# Altium project SDR2.PrjPcb (part 2 of 2)

## Sheet Ethernet.SchDoc: uSDR schematic
size Letter; Author: Ye-sheng Kuo; CompanyName: Univ. of Michigan; Revision: 2.0; SheetNumber: 7; SheetTotal: 16
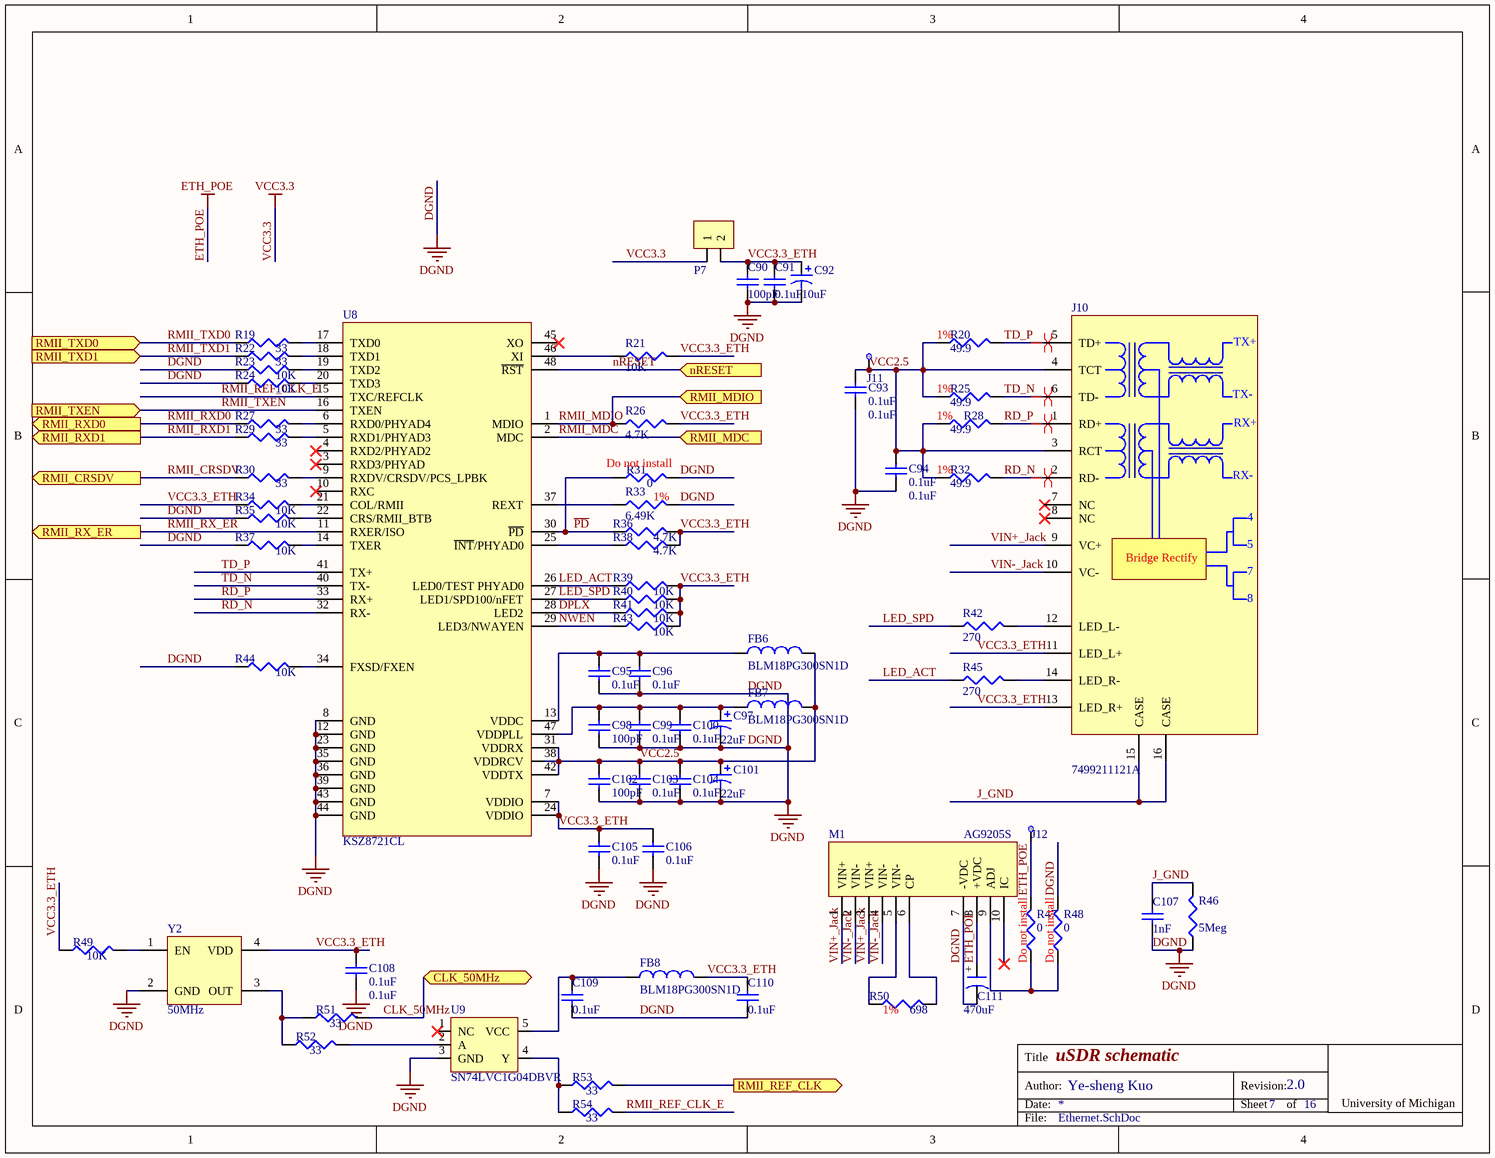
[diagram p10: Ethernet.SchDoc]

### Parts
C90  100pF  [0402]
C91  0.1uF  [0402]
C92  10uF  [C0805]
C93  0.1uF  [0402]
C94  0.1uF  [0402]
C95  0.1uF  [0402]
C96  0.1uF  [0402]
C97  22uF  [C0805]
C98  100pF  [0402]
C99  0.1uF  [0402]
C100  0.1uF  [0402]
C101  22uF  [C0805]
C102  100pF  [0402]
C103  0.1uF  [0402]
C104  0.1uF  [0402]
C105  0.1uF  [0402]
C106  0.1uF  [0402]
C107  1nF  [0402]
C108  0.1uF  [0402]
C109  0.1uF  [0402]
C110  0.1uF  [0402]
C111  470uF  [SMT Al Cap.]
FB6  BLM18PG300SN1D  [1608[0603]]
FB7  BLM18PG300SN1D  [1608[0603]]
FB8  BLM18PG300SN1D  [1608[0603]]
J10  7499211121A  [7499211121A]
J11  5004  [TestPoint]  (value not drawn)
J12  5004  [TestPoint]  (value not drawn)
M1  AG9205S  [AG9205S]
P7  1 x 2 header  [1x2 header]  (value not drawn)
R19  33  [0402]
R20  49.9  [0402]
R21  10K  [0402]
R22  33  [0402]
R23  10K  [0402]
R24  10K  [0402]
R25  49.9  [0402]
R26  4.7K  [0402]
R27  33  [0402]
R28  49.9  [0402]
R29  33  [0402]
R30  33  [0402]
R31  0  [0402]
R32  49.9  [0402]
R33  6.49K  [0402]
R34  10K  [0402]
R35  10K  [0402]
R36  4.7K  [0402]
R37  10K  [0402]
R38  4.7K  [0402]
R39  10K  [0402]
R40  10K  [0402]
R41  10K  [0402]
R42  270  [0402]
R43  10K  [0402]
R44  10K  [0402]
R45  270  [0402]
R46  value 5Meg  [J1-0603]  (hidden comment: 5M)
R47  0  [0402]
R48  0  [0402]
R49  10K  [0402]
R50  698  [0402]
R51  33  [0402]
R52  33  [0402]
R53  33  [0402]
R54  33  [0402]
U8  KSZ8721CL  [TSQFP50P900X900X160-48N]
U9  SN74LVC1G04DBVR  [SOT23-5]
Y2  value 50MHz  [CB3_CB3LV]  (hidden comment: CB3LV-3C-50M0000)

### Ports
CLK_50MHz (bidir), nRESET (in), RMII_CRSDV (out), RMII_MDC (in), RMII_MDIO (in), RMII_REF_CLK (out), RMII_RX_ER (out), RMII_RXD0 (out), RMII_RXD1 (out), RMII_TXD0 (in), RMII_TXD1 (in), RMII_TXEN (in)

### Nets
DGND: C90.1 C91.1 C92.2 C93.1 C94.1 C95.1 C96.1 C97.2 C98.1 C99.1 C100.1 C101.2 C102.1 C103.1 C104.1 C105.1 C106.1 C107.1 C108.1 C109.1 C110.1 C111.- M1.7(-VDC) R23.1 R24.1 R31.2 R33.2 R35.1 R37.1 R44.1 R46.1 R48.2 U8.8(GND) U8.12(GND) U8.23(GND) U8.35(GND) U8.36(GND) U8.39(GND) U8.43(GND) U8.44(GND) U9.3(GND) Y2.2(GND)
ETH_POE: C111.+ J12.1(TB) M1.8(+VDC) R47.2
VCC3.3: P7.1
CLK_50MHz: R51.2 ; port CLK_50MHz
DPLX: R41.1 U8.28(LED2)
J_GND: C107.2 J10.15(CASE) J10.16(CASE) R46.2
LED_ACT: R39.1 R45.1 U8.26(LED0/TEST_PHYAD0)
LED_SPD: R40.1 R42.1 U8.27(LED1/SPD100/nFET)
nRESET: U8.48(~{RST}) ; port nRESET
NWEN: R43.1 U8.29(LED3/NWAYEN)
~{PD}: R31.1 R36.1 U8.30(~{PD})
RD_N: J10.2(RD-) R32.2 U8.32(RX-)
RD_P: J10.1(RD+) R28.2 U8.33(RX+)
RMII_CRSDV: R30.1 ; port RMII_CRSDV
RMII_MDC: U8.2(MDC) ; port RMII_MDC
RMII_MDIO: R26.1 U8.1(MDIO) ; port RMII_MDIO
RMII_REF_CLK: R53.2 ; port RMII_REF_CLK
RMII_REF_CLK_E: R54.2 U8.15(TXC/REFCLK)
RMII_RX_ER: U8.11(RXER/ISO) ; port RMII_RX_ER
RMII_RXD0: R27.1 ; port RMII_RXD0
RMII_RXD1: R29.1 ; port RMII_RXD1
RMII_TXD0: R19.1 ; port RMII_TXD0
RMII_TXD1: R22.1 ; port RMII_TXD1
RMII_TXEN: U8.16(TXEN) ; port RMII_TXEN
TD_N: J10.6(TD-) R25.2 U8.40(TX-)
TD_P: J10.5(TD+) R20.2 U8.41(TX+)
VCC2.5: C93.2 C94.2 C101.1 C102.2 C103.2 C104.2 FB6.2 FB7.2 J10.3(RCT) J10.4(TCT) J11.1(TB) R20.1 R25.1 R28.1 R32.1 U8.31(VDDRX) U8.38(VDDRCV) U8.42(VDDTX)
VCC3.3_ETH: C90.2 C91.2 C92.1 C105.2 C106.2 C108.2 C110.2 FB8.2 J10.11(LED_L+) J10.13(LED_R+) P7.2 R21.2 R26.2 R34.1 R36.2 R38.2 R39.2 R40.2 R41.2 R43.2 R49.1 U8.7(VDDIO) U8.24(VDDIO) Y2.4(VDD)
VIN+_Jack: J10.9(VC+) M1.1(VIN+) M1.3(VIN+)
VIN-_Jack: J10.10(VC-) M1.2(VIN-) M1.4(VIN-)
NetC95_2: C95.2 C96.2 FB6.1 U8.13(VDDC)
NetC97_1: C97.1 C98.2 C99.2 C100.2 FB7.1 U8.47(VDDPLL)
NetC109_2: C109.2 FB8.1 U9.5(VCC)
NetJ10_12: J10.12(LED_L-) R42.2
NetJ10_14: J10.14(LED_R-) R45.2
NetM1_5: M1.5(VIN-) R50.1
NetM1_6: M1.6(CP) R50.2
NetM1_9: M1.9(ADJ) R47.1 R48.1
NetR19_2: R19.2 U8.17(TXD0)
NetR21_1: R21.1 U8.46(XI)
NetR22_2: R22.2 U8.18(TXD1)
NetR23_2: R23.2 U8.19(TXD2)
NetR24_2: R24.2 U8.20(TXD3)
NetR27_2: R27.2 U8.6(RXD0/PHYAD4)
NetR29_2: R29.2 U8.5(RXD1/PHYAD3)
NetR30_2: R30.2 U8.9(RXDV/CRSDV/PCS_LPBK)
NetR33_1: R33.1 U8.37(REXT)
NetR34_2: R34.2 U8.21(COL/RMII)
NetR35_2: R35.2 U8.22(CRS/RMII_BTB)
NetR37_2: R37.2 U8.14(TXER)
NetR38_1: R38.1 U8.25(~{INT}/PHYAD0)
NetR44_2: R44.2 U8.34(FXSD/FXEN)
NetR49_2: R49.2 Y2.1(EN)
NetR51_1: R51.1 R52.1 Y2.3(OUT)
NetR52_2: R52.2 U9.2(A)
NetR53_1: R53.1 R54.1 U9.4(Y)

Not connected (* = marked no-connect by the designer): J10 7(NC)* 8(NC)*; M1 10(IC)*; U8 3(RXD3/PHYAD)* 4(RXD2/PHYAD2)* 10(RXC)* 45(XO)*; U9 1(NC)*

### Layout directives
differential pair: RD_N, RD_P, TD_N, TD_P

### Notes on the sheet
- (near R20) 1%
- (near R25) 1%
- (near R28) 1%
- (near R31) Do not install
- (near R33) 1%
- (near R32) 1%
- (near R47) Do not install
- (near R48) Do not install
- (near R50) 1%
- Title
- Date:
- Author:
- Revision:
- Sheet
- of
- University of Michigan
- File:
- (in symbol Ethernet Jack PoE) TX+; TX-; RX+; RX-; Bridge Rectify

### Library data of the parts
C90 C91 C93-C96 C98-C100 C102-C110 = Cap Semi: Capacitor (Semiconductor SIM Model); Published: 8-Jun-2000; LatestRevisionDate: 29-May-2009; LatestRevisionNote: IPC-7351 Footprint Added.; PackageReference: C1206; Publisher: Altium Limited; PackageDescription: Chip Capacitor
  C90 C98 C102: Value: 100pF
  C91 C93-C96 C99 C100 C103-C106 C108-C110: Value: 0.1uF
  C107: Value: 1nF
C92 C97 C101 = Cap Pol3: Polarized Capacitor (Surface Mount); Published: 8-Jun-2000; LatestRevisionDate: 29-May-2009; LatestRevisionNote: IPC-7351 Footprint Added.; PackageReference: C0805; Publisher: Altium Limited; PackageDescription: Chip Capacitor
  C92: Value: 10uF
  C97 C101: Value: 22uF
C111 = Cap: Value: 470uF; Supplier 1: Digi-Key; Supplier Part Number 1: PCE3184CT-ND
FB6-FB8 = Ferrite Bead: FERRITE CHIP 30 OHM 1000MA 0603; Supplier 1: Digi-Key; Supplier Part Number 1: 490-1035-2-ND
J10 = Ethernet Jack PoE: CONN RJ45 8-8 W/TRANSFORMER; Supplier 1: Digi-Key; Supplier Part Number 1: 732-1654-ND
J11 J12 = TestPoint: TEST POINT PC MINI .040"D YELLOW; Supplier 1: Digi-Key; Supplier Part Number 1: 5004K-ND; datasheet: http://mail.keyelco.com/ENG._DEPT/PDF%20CAT%20NO%20Drawings/5004.pdf
M1 = AG9205S: Silver Telecom AG9205S POE; Value: 5V; datasheet: http://www.silvertel.com/DataSheets/Ag9200v1-7.pdf
P7 = 1 x 2 header: 100 mils standard header
R19-R54 = Res3: Resistor; Published: 8-Jun-2000; LatestRevisionDate: 29-May-2009; LatestRevisionNote: IPC-7351 Footprint Added.; PackageReference: J1-0603; Publisher: Altium Limited; PackageDescription: Chip Resistor
  R19 R22 R27 R29 R30 R51-R54: Value: 33
  R20 R25 R28 R32: Value: 49.9
  R21 R23 R24 R34 R35 R37 R39-R41 R43 R44 R49: Value: 10K
  R26 R36 R38: Value: 4.7K
  R31 R47 R48: Value: 0
  R33: Value: 6.49K
  R42 R45: Value: 270
  R50: Value: 698
U8 = KSZ8721CL: IC TXRX PHY 10/100 3.3V 48-LQFP; Supplier 1: Digi-Key; Supplier Part Number 1: 576-1673-ND
U9 = SN74LVC1G04DBV: IC SINGLE INVERTER-GATE SOT-23-5; Supplier 1: Digi-Key; Supplier Part Number 1: 296-11599-1-ND
Y2 = CB3_CB3LV: OSC 50.000 MHZ 3.3V SMD; Supplier 1: Digi-Key; Supplier Part Number 1: CTX283LVCT-ND

## Sheet DAC.SchDoc: uSDR schematic
size Letter; Author: Ye-sheng Kuo; CompanyName: Univ. of Michigan; Revision: 2.0; SheetNumber: 4; SheetTotal: 16
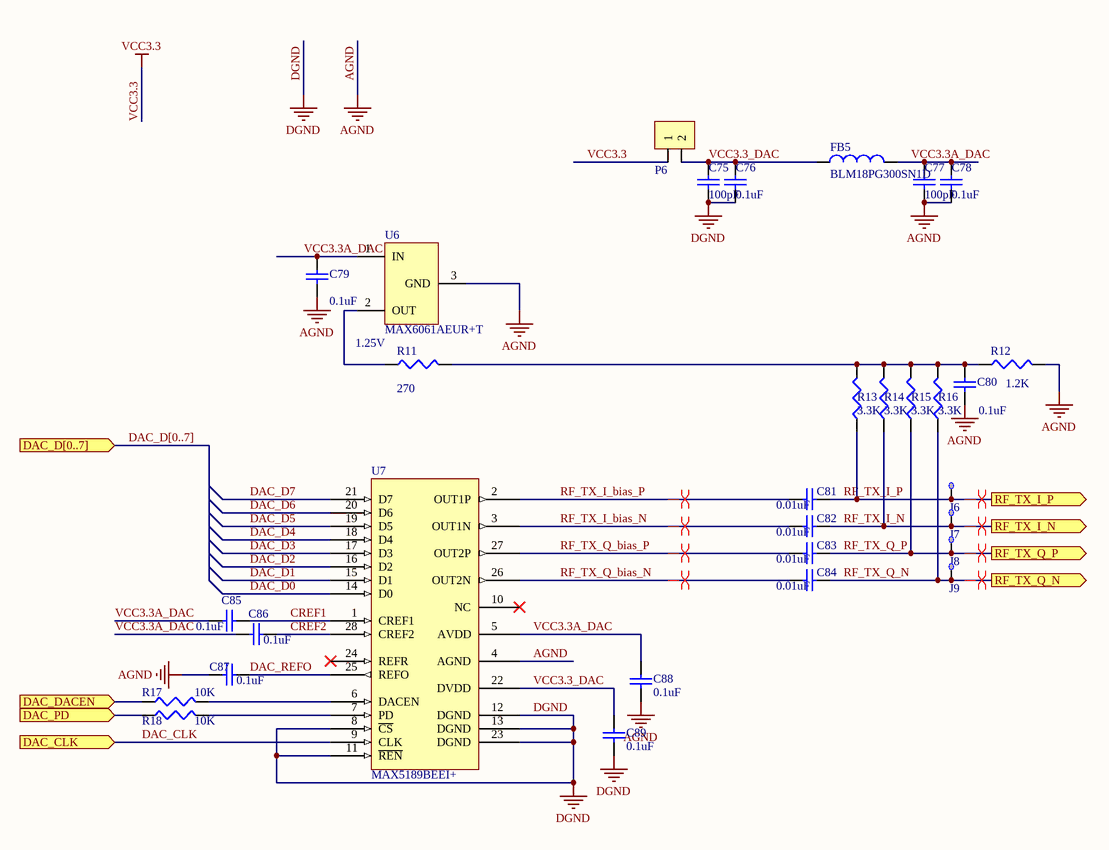
[diagram p11: DAC.SchDoc]

### Parts
C75  100pF  [0402]
C76  0.1uF  [0402]
C77  100pF  [0402]
C78  0.1uF  [0402]
C79  0.1uF  [0402]
C80  0.1uF  [0402]
C81  0.01uF  [0402]
C82  0.01uF  [0402]
C83  0.01uF  [0402]
C84  0.01uF  [0402]
C85  0.1uF  [0402]
C86  0.1uF  [0402]
C87  0.1uF  [0402]
C88  0.1uF  [0402]
C89  0.1uF  [0402]
FB5  BLM18PG300SN1D  [1608[0603]]
J6  5004  [TestPoint]  (value not drawn)
J7  5004  [TestPoint]  (value not drawn)
J8  5004  [TestPoint]  (value not drawn)
J9  5004  [TestPoint]  (value not drawn)
P6  1 x 2 header  [1x2 header]  (value not drawn)
R11  270  [0402]
R12  1.2K  [0402]
R13  3.3K  [0402]
R14  3.3K  [0402]
R15  3.3K  [0402]
R16  3.3K  [0402]
R17  10K  [0402]
R18  10K  [0402]
U6  MAX6061AEUR+T  value 1.25V  [SOT23-3N]
U7  MAX5189BEEI+  [SOP63P600X173-28N]

### Ports
DAC_CLK (in), DAC_D[0..7] (in), DAC_DACEN (in), DAC_PD (in), RF_TX_I_N (out), RF_TX_I_P (out), RF_TX_Q_N (out), RF_TX_Q_P (out)

### Nets
AGND: C77.1 C78.1 C79.1 C80.1 C87.1 C88.2 R12.2 U6.3(GND) U7.4(AGND)
DGND: C75.1 C76.1 C89.2 U7.8(~{CS}) U7.11(~{REN}) U7.12(DGND) U7.13(DGND) U7.23(DGND)
VCC3.3: P6.1
CREF1: C85.2 U7.1(CREF1)
CREF2: C86.2 U7.28(CREF2)
DAC_CLK: U7.9(CLK) ; port DAC_CLK
DAC_D0: U7.14(D0)
DAC_D1: U7.15(D1)
DAC_D2: U7.16(D2)
DAC_D3: U7.17(D3)
DAC_D4: U7.18(D4)
DAC_D5: U7.19(D5)
DAC_D6: U7.20(D6)
DAC_D7: U7.21(D7)
DAC_DACEN: R17.1 ; port DAC_DACEN
DAC_PD: R18.1 ; port DAC_PD
DAC_REFO: C87.2 U7.25(REFO)
RF_TX_I_bias_N: C82.1 U7.3(OUT1N)
RF_TX_I_bias_P: C81.1 U7.2(OUT1P)
RF_TX_I_N: C82.2 J7.1(TB) R14.1 ; port RF_TX_I_N
RF_TX_I_P: C81.2 J6.1(TB) R13.1 ; port RF_TX_I_P
RF_TX_Q_bias_N: C84.1 U7.26(OUT2N)
RF_TX_Q_bias_P: C83.1 U7.27(OUT2P)
RF_TX_Q_N: C84.2 J9.1(TB) R16.1 ; port RF_TX_Q_N
RF_TX_Q_P: C83.2 J8.1(TB) R15.1 ; port RF_TX_Q_P
VCC3.3_DAC: C75.2 C76.2 C89.1 FB5.1 P6.2 U7.22(DVDD)
VCC3.3A_DAC: C77.2 C78.2 C79.2 C85.1 C86.1 C88.1 FB5.2 U6.1(IN) U7.5(AVDD)
NetC80_2: C80.2 R11.2 R12.1 R13.2 R14.2 R15.2 R16.2
NetR11_1: R11.1 U6.2(OUT)
NetR17_2: R17.2 U7.6(DACEN)
NetR18_2: R18.2 U7.7(PD)

Not connected (* = marked no-connect by the designer): U7 10(NC)* 24(REFR)*

### Buses and harness runs
bus DAC_D[0..7] = port DAC_D[0..7]

### Layout directives
differential pair: RF_TX_I_bias_N, RF_TX_I_bias_P, RF_TX_I_N, RF_TX_I_P, RF_TX_Q_bias_N, RF_TX_Q_bias_P, RF_TX_Q_N, RF_TX_Q_P

### Notes on the sheet
- Title
- Date:
- Author:
- Revision:
- Sheet
- of
- University of Michigan
- File:

### Library data of the parts
C75-C89 = Cap Semi: Capacitor (Semiconductor SIM Model); Published: 8-Jun-2000; LatestRevisionDate: 29-May-2009; LatestRevisionNote: IPC-7351 Footprint Added.; PackageReference: C1206; Publisher: Altium Limited; PackageDescription: Chip Capacitor
  C75 C77: Value: 100pF
  C76 C78-C80 C85-C89: Value: 0.1uF
  C81-C84: Value: 0.01uF
FB5 = Ferrite Bead: FERRITE CHIP 30 OHM 1000MA 0603; Supplier 1: Digi-Key; Supplier Part Number 1: 490-1035-2-ND
J6-J9 = TestPoint: TEST POINT PC MINI .040"D YELLOW; Supplier 1: Digi-Key; Supplier Part Number 1: 5004K-ND; datasheet: http://mail.keyelco.com/ENG._DEPT/PDF%20CAT%20NO%20Drawings/5004.pdf
P6 = 1 x 2 header: 100 mils standard header
R11-R18 = Res3: Resistor; Published: 8-Jun-2000; LatestRevisionDate: 29-May-2009; LatestRevisionNote: IPC-7351 Footprint Added.; PackageReference: J1-0603; Publisher: Altium Limited; PackageDescription: Chip Resistor
  R11: Value: 270
  R12: Value: 1.2K
  R13-R16: Value: 3.3K
  R17 R18: Value: 10K
U6 = MAX6061: IC REF VOLT LDO SOT23-3; Supplier 1: Digi-Key; Supplier Part Number 1: MAX6061AEUR+TCT-ND
U7 = MAX5189: IC DAC 8BIT DUAL 40MHZ 28-QSOP; Supplier 1: Digi-Key; Supplier Part Number 1: MAX5189BEEI+-ND

## Sheet RF.SchDoc: uSDR schematic
size Letter; Author: Ye-sheng Kuo; CompanyName: Univ. of Michigan; Revision: 2.0; SheetNumber: 5; SheetTotal: 16
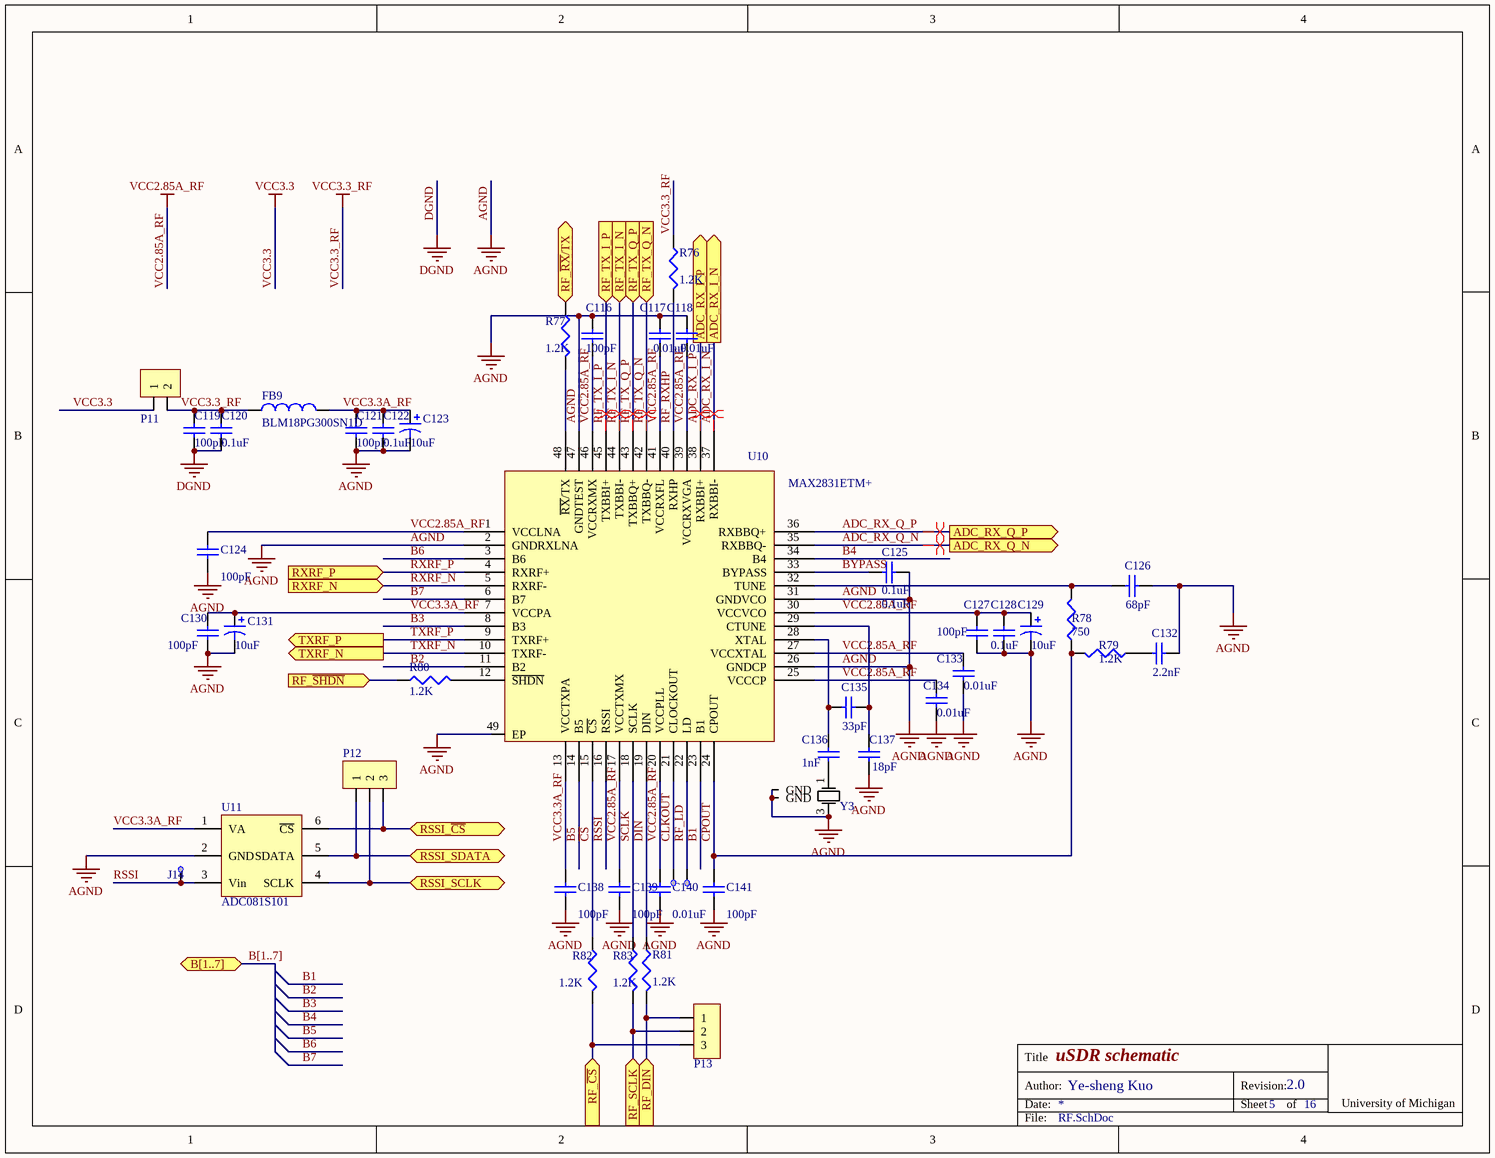
[diagram p12: RF.SchDoc]

### Parts
C116  100pF  [0402]
C117  0.01uF  [0402]
C118  0.01uF  [0402]
C119  100pF  [0402]
C120  0.1uF  [0402]
C121  100pF  [0402]
C122  0.1uF  [0402]
C123  10uF  [C0805]
C124  100pF  [0402]
C125  0.1uF  [0402]
C126  68pF  [0402]
C127  100pF  [0402]
C128  0.1uF  [0402]
C129  10uF  [C0805]
C130  100pF  [0402]
C131  10uF  [C0805]
C132  2.2nF  [0402]
C133  0.01uF  [0402]
C134  0.01uF  [0402]
C135  33pF  [0402]
C136  1nF  [0402]
C137  18pF  [0402]
C138  100pF  [0402]
C139  100pF  [0402]
C140  0.01uF  [0402]
C141  100pF  [0402]
FB9  BLM18PG300SN1D  [1608[0603]]
J14  5004  [TestPoint]  (value not drawn)
J15  5004  [TestPoint]  (value not drawn)
J16  5004  [TestPoint]  (value not drawn)
P11  1 x 2 header  [1x2 header]  (value not drawn)
P12  1 x 3 header  [1x3 header]  (value not drawn)
P13  1 x 3 header  [1x3 header]  (value not drawn)
R76  1.2K  [0402]
R77  1.2K  [0402]
R78  750  [0402]
R79  1.2K  [0402]
R80  1.2K  [0402]
R81  1.2K  [0402]
R82  1.2K  [0402]
R83  1.2K  [0402]
U10  MAX2831ETM+  [TQFN-48]
U11  ADC081S101  [SOT23-6]
Y3  CX2520SB40000H0DZF08  [CX-2520SB]  (value not drawn)

### Ports
ADC_RX_I_N (out), ADC_RX_I_P (out), ADC_RX_Q_N (out), ADC_RX_Q_P (out), B[1..7] (bidir), RF_DIN (in), RF_SCLK (in), RF_TX_I_N (in), RF_TX_I_P (in), RF_TX_Q_N (in), RF_TX_Q_P (in), RF_~{CS} (in), RF_~{RX}/TX (in), RF_~{SHDN} (in), RSSI_SCLK (bidir), RSSI_SDATA (bidir), RSSI_~{CS} (bidir), RXRF_N (in), RXRF_P (in), TXRF_N (out), TXRF_P (out)

### Nets
AGND: C116.2 C117.2 C118.2 C121.1 C122.1 C123.2 C124.1 C125.2 C126.2 C127.1 C128.1 C129.2 C130.1 C131.2 C132.2 C133.1 C134.1 C137.1 C138.1 C139.1 C140.1 C141.1 U10.2(GNDRXLNA) U10.26(GNDCP) U10.31(GNDVCO) U10.47(GNDTEST) U10.49(EP) U11.2(GND) Y3.2(GND) Y3.3(HOT) Y3.4(GND)
DGND: C119.1 C120.1
VCC2.85A_RF: C116.1 C117.1 C118.1 C124.2 C127.2 C128.2 C129.1 C133.2 C134.2 C139.2 C140.2 U10.1(VCCLNA) U10.17(VCCTXMX) U10.20(VCCPLL) U10.25(VCCCP) U10.27(VCCXTAL) U10.30(VCCVCO) U10.39(VCCRXVGA) U10.41(VCCRXFL) U10.46(VCCRXMX)
VCC3.3: P11.1
VCC3.3_RF: C119.2 C120.2 FB9.1 P11.2 R76.1
ADC_RX_I_N: U10.37(RXBBI-) ; port ADC_RX_I_N
ADC_RX_I_P: U10.38(RXBBI+) ; port ADC_RX_I_P
ADC_RX_Q_N: U10.35(RXBBQ-) ; port ADC_RX_Q_N
ADC_RX_Q_P: U10.36(RXBBQ+) ; port ADC_RX_Q_P
B1: U10.23(B1)
B2: U10.11(B2)
B3: U10.8(B3)
B4: U10.34(B4)
B5: U10.14(B5)
B6: U10.3(B6)
B7: U10.6(B7)
BYPASS: C125.1 U10.33(BYPASS)
~{CS}: R82.1 U10.15(~{CS})
CLKOUT: J15.1(TB) U10.21(CLOCKOUT)
CPOUT: C141.2 R78.1 R79.2 U10.24(CPOUT)
DIN: R81.1 U10.19(DIN)
RF_~{CS}: P13.3 R82.2 ; port RF_~{CS}
RF_DIN: P13.1 R81.2 ; port RF_DIN
RF_LD: J16.1(TB) U10.22(LD)
RF_~{RX}/TX: R77.1 ; port RF_~{RX}/TX
RF_RXHP: R76.2 U10.40(RXHP)
RF_~{SHDN}: R80.1 ; port RF_~{SHDN}
RF_SCLK: P13.2 R83.2 ; port RF_SCLK
RF_TX_I_N: U10.44(TXBBI-) ; port RF_TX_I_N
RF_TX_I_P: U10.45(TXBBI+) ; port RF_TX_I_P
RF_TX_Q_N: U10.42(TXBBQ-) ; port RF_TX_Q_N
RF_TX_Q_P: U10.43(TXBBQ+) ; port RF_TX_Q_P
RSSI: J14.1(TB) U10.16(RSSI) U11.3(Vin)
RSSI_~{CS}: P12.3 U11.6(~{CS}) ; port RSSI_~{CS}
RSSI_SCLK: P12.2 U11.4(SCLK) ; port RSSI_SCLK
RSSI_SDATA: P12.1 U11.5(SDATA) ; port RSSI_SDATA
RXRF_N: U10.5(RXRF-) ; port RXRF_N
RXRF_P: U10.4(RXRF+) ; port RXRF_P
SCLK: R83.1 U10.18(SCLK)
TXRF_N: U10.10(TXRF-) ; port TXRF_N
TXRF_P: U10.9(TXRF+) ; port TXRF_P
VCC3.3A_RF: C121.2 C122.2 C123.1 C130.2 C131.1 C138.2 FB9.2 U10.7(VCCPA) U10.13(VCCTXPA) U11.1(VA)
NetC126_1: C126.1 R78.2 U10.32(TUNE)
NetC132_1: C132.1 R79.1
NetC135_1: C135.1 C136.2 U10.28(XTAL)
NetC135_2: C135.2 C137.2 U10.29(CTUNE)
NetC136_1: C136.1 Y3.1(HOT)
NetR77_2: R77.2 U10.48(~{RX}/TX)
NetR80_2: R80.2 U10.12(~{SHDN})

### Buses and harness runs
bus B[1..7] = port B[1..7]

### Layout directives
differential pair: ADC_RX_I_N, ADC_RX_I_P, ADC_RX_Q_N, ADC_RX_Q_P, RF_TX_I_N, RF_TX_I_P, RF_TX_Q_N, RF_TX_Q_P

### Notes on the sheet
- Title
- Date:
- Author:
- Revision:
- Sheet
- of
- University of Michigan
- File:

### Library data of the parts
C116-C122 C124-C128 C130 C132-C141 = Cap Semi: Capacitor (Semiconductor SIM Model); Published: 8-Jun-2000; LatestRevisionDate: 29-May-2009; LatestRevisionNote: IPC-7351 Footprint Added.; PackageReference: C1206; Publisher: Altium Limited; PackageDescription: Chip Capacitor
  C116 C119 C121 C124 C127 C130 C138 C139 C141: Value: 100pF
  C117 C118 C133 C134 C140: Value: 0.01uF
  C120 C122 C125 C128: Value: 0.1uF
  C126: Value: 68pF
  C132: Value: 2.2nF
  C135: Value: 33pF
  C136: Value: 1nF
  C137: Value: 18pF
C123 C129 C131 = Cap Pol3: Polarized Capacitor (Surface Mount); Published: 8-Jun-2000; LatestRevisionDate: 29-May-2009; LatestRevisionNote: IPC-7351 Footprint Added.; PackageReference: C0805; Publisher: Altium Limited; PackageDescription: Chip Capacitor; Value: 10uF
FB9 = Ferrite Bead: FERRITE CHIP 30 OHM 1000MA 0603; Supplier 1: Digi-Key; Supplier Part Number 1: 490-1035-2-ND
J14-J16 = TestPoint: TEST POINT PC MINI .040"D YELLOW; Supplier 1: Digi-Key; Supplier Part Number 1: 5004K-ND; datasheet: http://mail.keyelco.com/ENG._DEPT/PDF%20CAT%20NO%20Drawings/5004.pdf
P11 = 1 x 2 header: 100 mils standard header
P12 P13 = 1 x 3 header: 100 mils standard header
R76-R83 = Res3: Resistor; Published: 8-Jun-2000; LatestRevisionDate: 29-May-2009; LatestRevisionNote: IPC-7351 Footprint Added.; PackageReference: J1-0603; Publisher: Altium Limited; PackageDescription: Chip Resistor
  R76 R77 R79-R83: Value: 1.2K
  R78: Value: 750
U10 = MAX2831: RF Transceiver 2.4-2.5GHz 802.11g/b RF Transceiver; Supplier 1: Mouser; Supplier Part Number 1: 700-MAX2831ETM+
U11 = ADC081S101: IC ADC 8BIT 1MSPS SOT23-6
Y3 = CX-2520SB: CRYSTAL 40.000MHZ 12PF SMD; Value: 40MHz; Supplier 1: Digi-Key; Supplier Part Number 1: 478-4818-1-ND; datasheet: http://global.kyocera.com/prdct/electro/pdf/xtal/cx2520db_cs_e.pdf

## Sheet PWR_Gen.SchDoc: uSDR schematic
size Letter; Author: Ye-sheng Kuo; CompanyName: Univ. of Michigan; Revision: 2.0; SheetNumber: 2; SheetTotal: 16
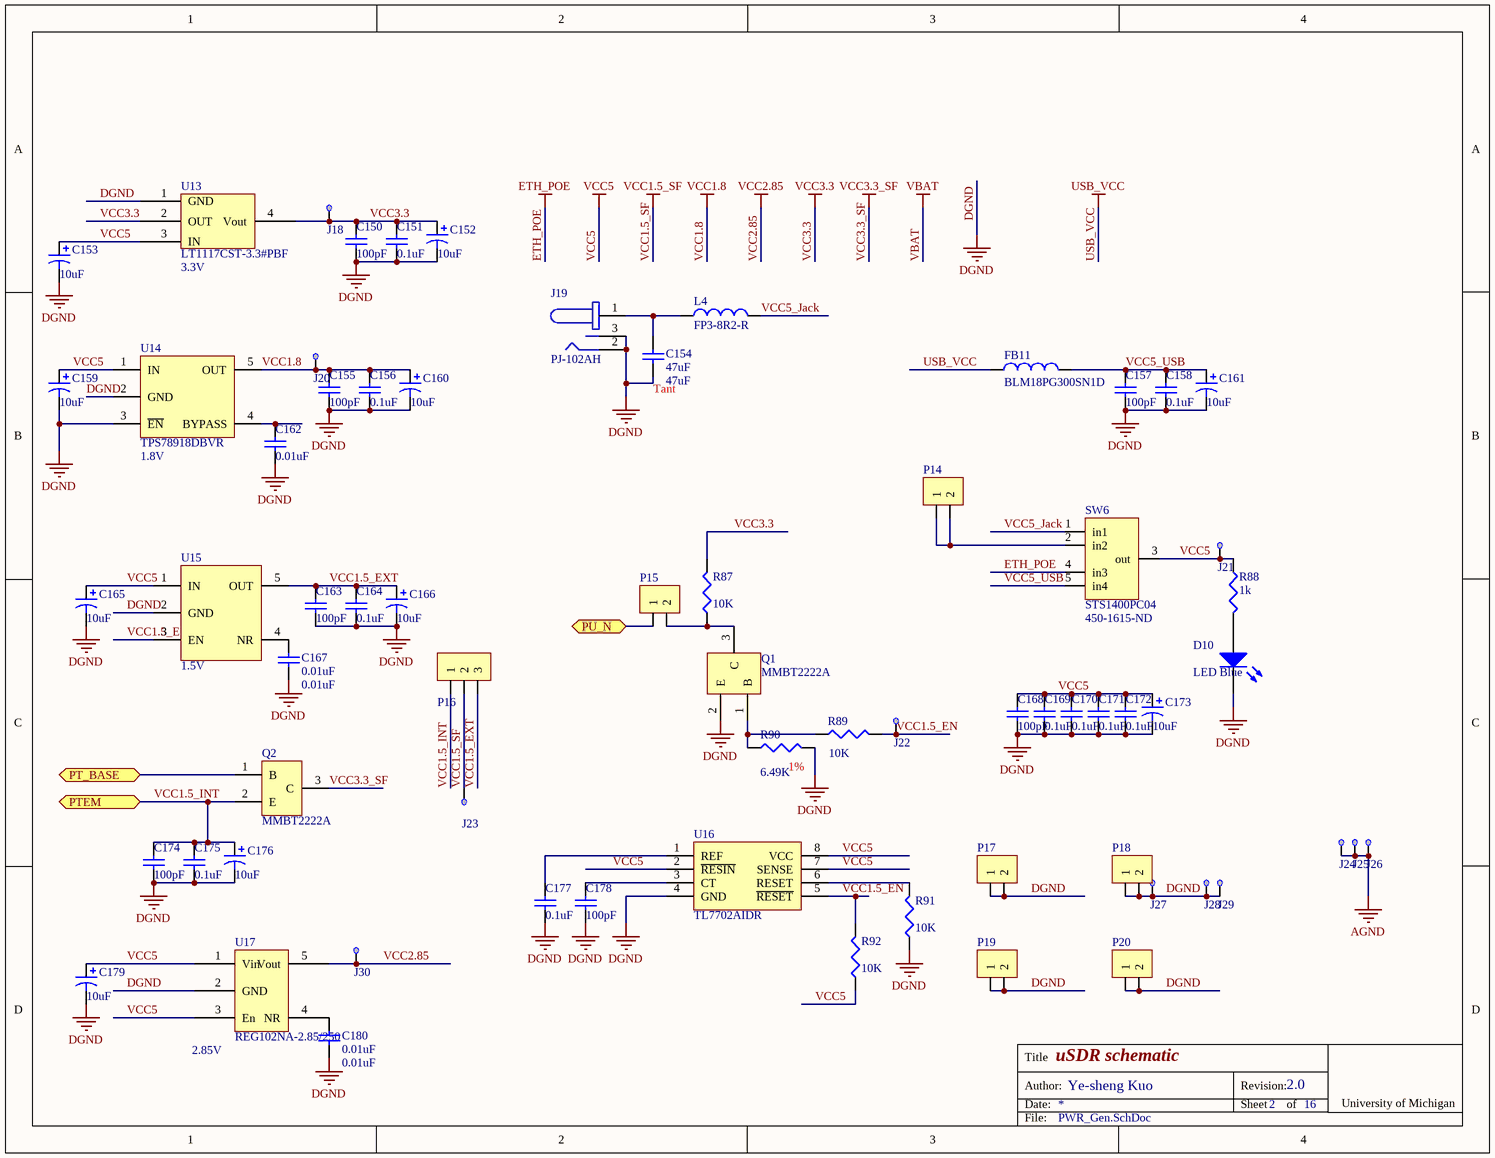
[diagram p13: PWR_Gen.SchDoc]

### Parts
C150  100pF  [0402]
C151  0.1uF  [0402]
C152  10uF  [C0805]
C153  10uF  [C0805]
C154  47uF  [C1210]
C155  100pF  [0402]
C156  0.1uF  [0402]
C157  100pF  [0402]
C158  0.1uF  [0402]
C159  10uF  [C0805]
C160  10uF  [C0805]
C161  10uF  [C0805]
C162  0.01uF  [0402]
C163  100pF  [0402]
C164  0.1uF  [0402]
C165  10uF  [C0805]
C166  10uF  [C0805]
C167  0.01uF  [0402]
C168  100pF  [0402]
C169  0.1uF  [0402]
C170  0.1uF  [0402]
C171  0.1uF  [0402]
C172  0.1uF  [0402]
C173  10uF  [C0805]
C174  100pF  [0402]
C175  0.1uF  [0402]
C176  10uF  [C0805]
C177  0.1uF  [0402]
C178  100pF  [0402]
C179  10uF  [C0805]
C180  0.01uF  [0402]
D10  LED Blue  [1608[0603]]
FB11  BLM18PG300SN1D  [1608[0603]]
J18  5004  [TestPoint]  (value not drawn)
J19  PJ-102AH  [PJ-102AH]
J20  5004  [TestPoint]  (value not drawn)
J21  5004  [TestPoint]  (value not drawn)
J22  5004  [TestPoint]  (value not drawn)
J23  5004  [TestPoint]  (value not drawn)
J24  5004  [TestPoint]  (value not drawn)
J25  5004  [TestPoint]  (value not drawn)
J26  5004  [TestPoint]  (value not drawn)
J27  5004  [TestPoint]  (value not drawn)
J28  5004  [TestPoint]  (value not drawn)
J29  5004  [TestPoint]  (value not drawn)
J30  5004  [TestPoint]  (value not drawn)
L4  FP3-8R2-R  [FLAT-PAC]
P14  1 x 2 header  [1x2 header]  (value not drawn)
P15  1 x 2 header  [1x2 header]  (value not drawn)
P16  1 x 3 header  [1x3 header]  (value not drawn)
P17  1 x 2 header  [1x2 header]  (value not drawn)
P18  1 x 2 header  [1x2 header]  (value not drawn)
P19  1 x 2 header  [1x2 header]  (value not drawn)
P20  1 x 2 header  [1x2 header]  (value not drawn)
Q1  MMBT2222A  [SOT23-3N]
Q2  MMBT2222A  [SOT23-3N]
R87  10K  [0402]
R88  1K  [0402]
R89  10K  [0402]
R90  6.49K  [0402]
R91  10K  [0402]
R92  10K  [0402]
SW6  STS1400PC04  Supplier Part Number 1: 450-1615-ND  [STS1400PC04]
U13  LT1117CST-3.3#PBF  value 3.3V  [SOT223-4L]
U14  TPS78918DBVR  value 1.8V  [SOT23-5]
U15  value 1.5V  [SOT23-5]  (hidden comment: TPS73115DBVT)
U16  TL7702AIDR  [SOIC127P600X175-8N]
U17  REG102NA-2.85/250  value 2.85V  [SOT23-5]

### Ports
PT_BASE, PTEM, PU_N

### Nets
AGND: J24.1(TB) J25.1(TB) J26.1(TB)
DGND: C150.1 C151.1 C152.2 C153.2 C154.1 C155.1 C156.1 C157.1 C158.1 C159.2 C160.2 C161.2 C162.1 C163.1 C164.1 C165.2 C166.2 C167.1 C168.1 C169.1 C170.1 C171.1 C172.1 C173.2 C174.1 C175.1 C176.2 C177.1 C178.1 C179.2 C180.1 D10.2(K) J19.2 J19.3 J27.1(TB) J28.1(TB) J29.1(TB) P17.1 P17.2 P18.1 P18.2 P19.1 P19.2 P20.1 P20.2 Q1.2(E) R90.2 R91.1 U13.1(GND) U14.2(GND) U14.3(~{EN}) U15.2(GND) U16.4(GND) U17.2(GND)
ETH_POE: SW6.4(in3)
USB_VCC: FB11.1
VCC1.5_SF: J23.1(TB) P16.2
VCC1.8: C155.2 C156.2 C160.1 J20.1(TB) U14.5(OUT)
VCC2.85: J30.1(TB) U17.5(Vout)
VCC3.3: C150.2 C151.2 C152.1 J18.1(TB) R87.2 U13.2(OUT) U13.4(Vout)
VCC3.3_SF: Q2.3(C)
VCC5: C153.1 C159.1 C165.1 C168.2 C169.2 C170.2 C171.2 C172.2 C173.1 C179.1 J21.1(TB) R88.1 R92.1 SW6.3(out) U13.3(IN) U14.1(IN) U15.1(IN) U16.2(~{RESIN}) U16.7(SENSE) U16.8(VCC) U17.1(Vin) U17.3(En)
PU_N: P15.1 ; port PU_N
VCC1.5_EN: J22.1(TB) R89.2 R92.2 U15.3(EN) U16.5(~{RESET})
VCC1.5_EXT: C163.2 C164.2 C166.1 P16.3 U15.5(OUT)
VCC1.5_INT: C174.2 C175.2 C176.1 P16.1 Q2.2(E) ; port PTEM
VCC5_Jack: L4.2 SW6.1(in1)
VCC5_USB: C157.2 C158.2 C161.1 FB11.2 SW6.5(in4)
NetC154_2: C154.2 J19.1 L4.1
NetC162_2: C162.2 U14.4(BYPASS)
NetC167_2: C167.2 U15.4(NR)
NetC177_2: C177.2 U16.1(REF)
NetC178_2: C178.2 U16.3(CT)
NetC180_2: C180.2 U17.4(NR)
NetD10_1: D10.1(A) R88.2
NetP14_1: P14.1 P14.2 SW6.2(in2)
NetP15_2: P15.2 Q1.3(C) R87.1
NetQ1_1: Q1.1(B) R89.1 R90.1
NetQ2_1: Q2.1(B) ; port PT_BASE
NetR91_2: R91.2 U16.6(RESET)

### Notes on the sheet
- (near C154) Tant
- (near R90) 1%
- Title
- Date:
- Author:
- Revision:
- Sheet
- of
- University of Michigan
- File:

### Library data of the parts
C150 C151 C154-C158 C162-C164 C167-C172 C174 C175 C177 C178 C180 = Cap Semi: Capacitor (Semiconductor SIM Model); Published: 8-Jun-2000; LatestRevisionDate: 29-May-2009; LatestRevisionNote: IPC-7351 Footprint Added.; PackageReference: C1206; Publisher: Altium Limited; PackageDescription: Chip Capacitor
  C150 C155 C157 C163 C168 C174 C178: Value: 100pF
  C151 C156 C158 C164 C169-C172 C175 C177: Value: 0.1uF
  C154: Value: 47uF
  C162 C167 C180: Value: 0.01uF
C152 C153 C159-C161 C165 C166 C173 C176 C179 = Cap Pol3: Polarized Capacitor (Surface Mount); Published: 8-Jun-2000; LatestRevisionDate: 29-May-2009; LatestRevisionNote: IPC-7351 Footprint Added.; PackageReference: C0805; Publisher: Altium Limited; PackageDescription: Chip Capacitor; Value: 10uF
D10 = LED2: Typical RED, GREEN, YELLOW, AMBER GaAs LED; Published: 8-Jun-2000; LatestRevisionDate: 17-Jul-2002; LatestRevisionNote: Re-released for DXP Platform.; PackageVersion: Feb-2002; PackageReference: 3.2X1.6X1.1; Publisher: Altium Limited; PackageDescription: SM LED; 2 Flat Leads
FB11 = Ferrite Bead: FERRITE CHIP 30 OHM 1000MA 0603; Supplier 1: Digi-Key; Supplier Part Number 1: 490-1035-2-ND
J18 J20-J30 = TestPoint: TEST POINT PC MINI .040"D YELLOW; Supplier 1: Digi-Key; Supplier Part Number 1: 5004K-ND; datasheet: http://mail.keyelco.com/ENG._DEPT/PDF%20CAT%20NO%20Drawings/5004.pdf
J19 = PJ-102AH: CONN PWR JACK 2.1X5.5MM HIGH CUR; Supplier 1: Digi-Key; Supplier Part Number 1: CP-102AH-ND
L4 = Inductor: Code_IEC: 1005; Value: 10mH; Published: 8-Jun-2000; LatestRevisionDate: 29-May-2009; LatestRevisionNote: IPC-7351 Footprint Added.; PackageReference: 0402-A; Publisher: Altium Limited; PackageDescription: Chip Inductor; Code_JEITA: 0402
P14 P15 P17-P20 = 1 x 2 header: 100 mils standard header
P16 = 1 x 3 header: 100 mils standard header
Q1 Q2 = MMBT2222A: TRANSISTOR NPN GP 40V SOT23; Supplier 1: Digi-Key; Supplier Part Number 1: MMBT2222ATPMSCT-ND
R87-R92 = Res3: Resistor; Published: 8-Jun-2000; LatestRevisionDate: 29-May-2009; LatestRevisionNote: IPC-7351 Footprint Added.; PackageReference: J1-0603; Publisher: Altium Limited; PackageDescription: Chip Resistor
  R87 R89 R91 R92: Value: 10K
  R88: Value: 1k
  R90: Value: 6.49K
SW6 = STS1400PC04: Switch Slide 4 postions; Supplier 1: Digi-Key
U13 = LT1117-3.3: IC REG LDO 3.3V SOT-223; Supplier 1: Digi-Key; Supplier Part Number 1: LT1117CST-3.3#PBF-ND
U14 = TPS789 LDO: IC 1.8V 100MA LDO REG SOT-23-5; Supplier 1: Digi-Key; Supplier Part Number 1: 296-8147-1-ND
U15 = TPS731: IC LDO REG 150MA 1.5V SOT23-5; Supplier 1: Digi-Key; Supplier Part Number 1: 296-15801-1-ND
U16 = TL7702AIDR: IC SUPPLY VOLT SUPERVISOR 8-SOIC; Supplier 1: Digi-Key; Supplier Part Number 1: 296-15017-1-ND
U17 = REG102/103/104: IC REG LDO 2.85V 250MA SOT23-5; Supplier 1: Digi-Key; Supplier Part Number 1: REG102NA-2.85CT-ND

## Sheet RF_2.SchDoc: uSDR schematic
size Letter; Author: Ye-sheng Kuo; CompanyName: Univ. of Michigan; Revision: 2.0; SheetNumber: 6; SheetTotal: 16
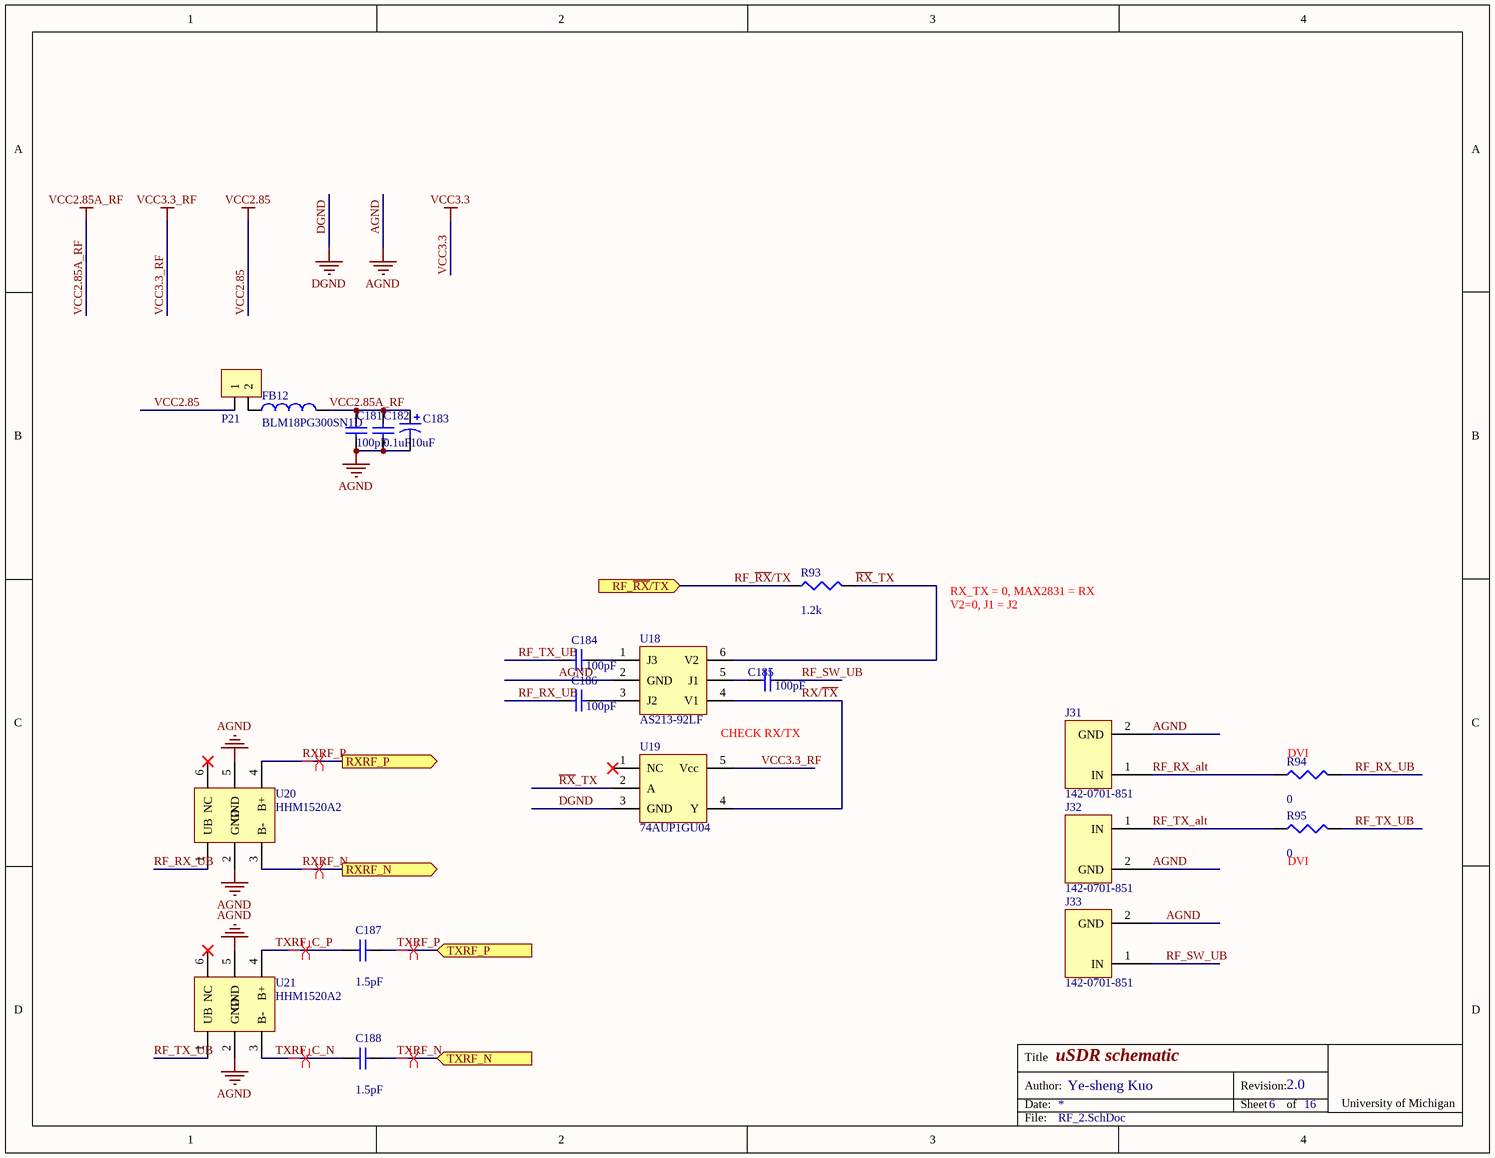
[diagram p14: RF_2.SchDoc]

### Parts
C181  100pF  [0402]
C182  0.1uF  [0402]
C183  10uF  [C0805]
C184  100pF  [0402]
C185  100pF  [0402]
C186  100pF  [0402]
C187  1.5pF  [0402]
C188  1.5pF  [0402]
FB12  BLM18PG300SN1D  [1608[0603]]
J31  142-0701-851  [SMA_SMD]
J32  142-0701-851  [SMA_SMD]
J33  142-0701-851  [SMA_SMD]
P21  1 x 2 header  [1x2 header]  (value not drawn)
R93  1.2K  [0402]
R94  0  [0402]
R95  0  [0402]
U18  AS213-92LF  [SOT363-6N]
U19  74AUP1GU04  [SOT353-5N]
U20  HHM1520A2  [HHM1520A2]
U21  HHM1520A2  [HHM1520A2]

### Ports
RF_~{RX}/TX (in), RXRF_N (out), RXRF_P (out), TXRF_N (in), TXRF_P (in)

### Nets
AGND: C181.1 C182.1 C183.2 J31.2(GND) J32.2(GND) J33.2(GND) U18.2(GND) U20.2(GND) U20.5(GND) U21.2(GND) U21.5(GND)
DGND: U19.3(GND)
VCC2.85: P21.1
VCC2.85A_RF: C181.2 C182.2 C183.1 FB12.2
VCC3.3_RF: U19.5(Vcc)
~{RX}_TX: R93.2 U18.6(V2) U19.2(A)
RF_~{RX}/TX: R93.1 ; port RF_~{RX}/TX
RF_RX_alt: J31.1(IN) R94.1
RF_RX_UB: C186.2 R94.2 U20.1(UB)
RF_SW_UB: C185.1 J33.1(IN)
RF_TX_alt: J32.1(IN) R95.1
RF_TX_UB: C184.2 R95.2 U21.1(UB)
RX/~{TX}: U18.4(V1) U19.4(Y)
RXRF_N: U20.3(B-) ; port RXRF_N
RXRF_P: U20.4(B+) ; port RXRF_P
TXRF_C_N: C188.2 U21.3(B-)
TXRF_C_P: C187.2 U21.4(B+)
TXRF_N: C188.1 ; port TXRF_N
TXRF_P: C187.1 ; port TXRF_P
NetC184_1: C184.1 U18.1(J3)
NetC185_2: C185.2 U18.5(J1)
NetC186_1: C186.1 U18.3(J2)
NetFB12_1: FB12.1 P21.2

Not connected (* = marked no-connect by the designer): U19 1(NC)*; U20 6(NC)*; U21 6(NC)*

### Layout directives
differential pair: RXRF_N, RXRF_P, TXRF_C_N, TXRF_C_P, TXRF_N, TXRF_P

### Notes on the sheet
- RX_TX = 0, MAX2831 = RX
- V2=0, J1 = J2
- CHECK RX/TX
- (near R94) DVI
- (near R95) DVI
- Title
- Date:
- Author:
- Revision:
- Sheet
- of
- University of Michigan
- File:

### Library data of the parts
C181 C182 C184-C188 = Cap Semi: Capacitor (Semiconductor SIM Model); Published: 8-Jun-2000; LatestRevisionDate: 29-May-2009; LatestRevisionNote: IPC-7351 Footprint Added.; PackageReference: C1206; Publisher: Altium Limited; PackageDescription: Chip Capacitor
  C181 C184-C186: Value: 100pF
  C182: Value: 0.1uF
  C187 C188: Value: 1.5pF
C183 = Cap Pol3: Polarized Capacitor (Surface Mount); Published: 8-Jun-2000; LatestRevisionDate: 29-May-2009; LatestRevisionNote: IPC-7351 Footprint Added.; PackageReference: C0805; Publisher: Altium Limited; PackageDescription: Chip Capacitor; Value: 10uF
FB12 = Ferrite Bead: FERRITE CHIP 30 OHM 1000MA 0603; Supplier 1: Digi-Key; Supplier Part Number 1: 490-1035-2-ND
J31-J33 = SMA_connector: CONN JACK END LAUNCH PC GOLD SMA; Supplier 1: Digi-Key; Supplier Part Number 1: J658-ND
P21 = 1 x 2 header: 100 mils standard header
R93-R95 = Res3: Resistor; Published: 8-Jun-2000; LatestRevisionDate: 29-May-2009; LatestRevisionNote: IPC-7351 Footprint Added.; PackageReference: J1-0603; Publisher: Altium Limited; PackageDescription: Chip Resistor
  R93: Value: 1.2k
  R94 R95: Value: 0
U18 = AS213-92LF: IC SW SPDT 0.1-3GHZ GAAS SC88; Supplier 1: Digi-Key; Supplier Part Number 1: 863-1238-1-ND; datasheet: http://www.skyworksinc.com/uploads/documents/200193D.pdf
U19 = 74AUP1GU04: IC UNBUFFERED INVERTER LP 5TSSOP; Supplier 1: Digi-Key; Supplier Part Number 1: 568-2573-1-ND; Datasheet: http://www.nxp.com/documents/data_sheet/74AUP1GU04.pdf
U20 U21 = TDK chip Balun: XFRMR BALUN RF 2.4GHZ SMD; Supplier 1: Digi-Key; Supplier Part Number 1: 445-3985-1-ND

## Sheet RTC.SchDoc: uSDR schematic
size Letter; Author: Ye-sheng Kuo; CompanyName: Univ. of Michigan; Revision: 2.0; SheetNumber: 9; SheetTotal: 16
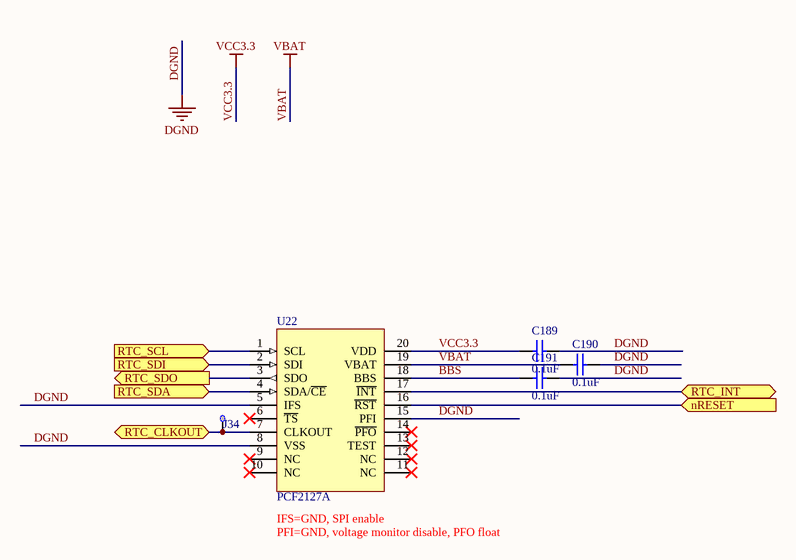
[diagram p15: RTC.SchDoc]

### Parts
C189  0.1uF  [0402]
C190  0.1uF  [0402]
C191  0.1uF  [0402]
J34  5004  [TestPoint]  (value not drawn)
U22  PCF2127A  [SOIC127P1030X265-20N]

### Ports
nRESET (in), RTC_CLKOUT, RTC_INT (bidir), RTC_SCL (in), RTC_SDA (in), RTC_SDI (in), RTC_SDO (out)

### Nets
DGND: C189.1 C190.1 C191.1 U22.5(IFS) U22.8(VSS) U22.15(PFI)
VBAT: C190.2 U22.19(VBAT)
VCC3.3: C189.2 U22.20(VDD)
BBS: C191.2 U22.18(BBS)
nRESET: U22.16(~{RST}) ; port nRESET
RTC_CLKOUT: J34.1(TB) U22.7(CLKOUT) ; port RTC_CLKOUT
RTC_INT: U22.17(~{INT}) ; port RTC_INT
RTC_SCL: U22.1(SCL) ; port RTC_SCL
RTC_SDA: U22.4(SDA/~{CE}) ; port RTC_SDA
RTC_SDI: U22.2(SDI) ; port RTC_SDI
RTC_SDO: U22.3(SDO) ; port RTC_SDO

Not connected (* = marked no-connect by the designer): U22 6(~{TS})* 9(NC)* 10(NC)* 11(NC)* 12(NC)* 13(TEST)* 14(~{PFO})*

### Notes on the sheet
- (near U22) IFS=GND, SPI enable
- PFI=GND, voltage monitor disable, PFO float
- Title
- Date:
- Author:
- Revision:
- Sheet
- of
- University of Michigan
- File:

### Library data of the parts
C189-C191 = Cap Semi: Capacitor (Semiconductor SIM Model); Published: 8-Jun-2000; LatestRevisionDate: 29-May-2009; LatestRevisionNote: IPC-7351 Footprint Added.; PackageReference: C1206; Publisher: Altium Limited; PackageDescription: Chip Capacitor; Value: 0.1uF
J34 = TestPoint: TEST POINT PC MINI .040"D YELLOW; Supplier 1: Digi-Key; Supplier Part Number 1: 5004K-ND; datasheet: http://mail.keyelco.com/ENG._DEPT/PDF%20CAT%20NO%20Drawings/5004.pdf
U22 = PCF2127A: IC REAL TIME CLK/CALENDAR 20SOIC; datasheet: http://www.nxp.com/documents/data_sheet/PCF2127A.pdf; Supplier 1: Digi-Key; Supplier Part Number 1: 568-4961-5-ND

## Nets that join several sheets
AGND: Digital_PWR (15 pins), Analog (21 pins), ACE (8 pins), ADC (6 pins), DAC (9 pins), RF (31 pins), PWR_Gen (J24.1 J25.1 J26.1), RF_2 (11 pins)
DGND: MEM (11 pins), Digital_PWR (31 pins), Analog (95 pins), usb_uart (17 pins), ACE (C50.1 C51.1 C52.2 U1.E17), Fabric_IO (8 pins), MSS_IO (11 pins), ADC (18 pins), Ethernet (42 pins), DAC (8 pins), RF (C119.1 C120.1), PWR_Gen (54 pins), RF_2 (U19.3), RTC (6 pins)
ETH_POE: Ethernet (C111.+ J12.1 M1.8 R47.2), PWR_Gen (SW6.4)
USB_VCC: usb_uart (C146.2 FB10.1 J17.1), PWR_Gen (FB11.1)
VBAT: Analog (C74.2 J5.pos U1.AB19), RTC (C190.2 U22.19)
VCC1.5_SF: Digital_PWR (41 pins), Analog (U1.N19), ACE (L2.2), PWR_Gen (J23.1 P16.2)
VCC1.5A_SF: Digital_PWR (8 pins), Analog (6 pins)
VCC1.8: MEM (P2.1), PWR_Gen (5 pins)
VCC2.85: PWR_Gen (J30.1 U17.5), RF_2 (P21.1)
VCC2.85A_RF: RF (20 pins), RF_2 (C181.2 C182.2 C183.1 FB12.2)
VCC3.3: MEM (P1.1 P3.1), Digital_PWR (P4.1), usb_uart (C142.2 U12.4), Fabric_IO (12 pins), MSS_IO (P10.7 P10.10 R67.2), ADC (P5.1), Ethernet (P7.1), DAC (P6.1), RF (P11.1), PWR_Gen (7 pins), RTC (C189.2 U22.20)
VCC3.3_RF: RF (5 pins), RF_2 (U19.5)
VCC3.3_SF: Digital_PWR (54 pins), Analog (10 pins), MSS_IO (6 pins), PWR_Gen (Q2.3)
VCC3.3A_SF: Digital_PWR (8 pins), Analog (7 pins)
ADC_A0: Fabric_IO (U1.C21), ADC (U5.37)
ADC_A1: Fabric_IO (U1.D21), ADC (U5.38)
ADC_A2: Fabric_IO (U1.B20), ADC (U5.39)
ADC_A3: Fabric_IO (U1.C19), ADC (U5.40)
ADC_A4: Fabric_IO (U1.G19), ADC (U5.41)
ADC_A5: Fabric_IO (U1.F19), ADC (U5.42)
ADC_A6: Fabric_IO (U1.G21), ADC (U5.43)
ADC_A7: Fabric_IO (U1.G20), ADC (U5.44)
ADC_B0: Fabric_IO (U1.K17), ADC (U5.24)
ADC_B1: Fabric_IO (U1.J17), ADC (U5.23)
ADC_B2: Fabric_IO (U1.F21), ADC (U5.22)
ADC_B3: Fabric_IO (U1.F20), ADC (U5.21)
ADC_B4: Fabric_IO (U1.G18), ADC (U5.20)
ADC_B5: Fabric_IO (U1.G17), ADC (U5.19)
ADC_B6: Fabric_IO (U1.E18), ADC (U5.18)
ADC_B7: Fabric_IO (U1.F17), ADC (U5.17)
ADC_CLK: Fabric_IO (U1.A17), ADC (U5.14 U5.47)
ADC_RX_I_N: ADC (C63.1), RF (U10.37)
ADC_RX_I_P: ADC (C62.1), RF (U10.38)
ADC_RX_Q_N: ADC (C66.1), RF (U10.35)
ADC_RX_Q_P: ADC (C68.1), RF (U10.36)
ADC_S1: Fabric_IO (U1.D18), ADC (R8.1)
B1: Fabric_IO (U1.D7), RF (U10.23)
B2: Fabric_IO (U1.E8), RF (U10.11)
B3: Fabric_IO (U1.C4), RF (U10.8)
B4: Fabric_IO (U1.C5), RF (U10.34)
B5: Fabric_IO (U1.D8), RF (U10.14)
B6: Fabric_IO (U1.C7), RF (U10.3)
B7: Fabric_IO (U1.C8), RF (U10.6)
CLK_50MHz: Fabric_IO (U1.E3), Ethernet (R51.2)
DAC_CLK: Fabric_IO (U1.A18), DAC (U7.9)
DAC_D0: Fabric_IO (U1.E1), DAC (U7.14)
DAC_D1: Fabric_IO (U1.F3), DAC (U7.15)
DAC_D2: Fabric_IO (U1.G4), DAC (U7.16)
DAC_D3: Fabric_IO (U1.H5), DAC (U7.17)
DAC_D4: Fabric_IO (U1.H6), DAC (U7.18)
DAC_D5: Fabric_IO (U1.J6), DAC (U7.19)
DAC_D6: Fabric_IO (U1.B22), DAC (U7.20)
DAC_D7: Fabric_IO (U1.C22), DAC (U7.21)
DAC_DACEN: Fabric_IO (U1.F1), DAC (R17.1)
DAC_PD: Fabric_IO (U1.G2), DAC (R18.1)
EMC_AB1: EMC (U1.A9), MEM (U2.A3 U3.31)
EMC_AB2: EMC (U1.B10), MEM (U2.A4 U3.26)
EMC_AB3: EMC (U1.B11), MEM (U2.A5 U3.25)
EMC_AB4: EMC (U1.E11), MEM (U2.B3 U3.24)
EMC_AB5: EMC (U1.E12), MEM (U2.B4 U3.23)
EMC_AB6: EMC (U1.B12), MEM (U2.C3 U3.22)
EMC_AB7: EMC (U1.A12), MEM (U2.C4 U3.21)
EMC_AB8: EMC (U1.C13), MEM (U2.D4 U3.20)
EMC_AB9: EMC (U1.D13), MEM (U2.H2 U3.10)
EMC_AB10: EMC (U1.D11), MEM (U2.H3 U3.9)
EMC_AB11: EMC (U1.D12), MEM (U2.H4 U3.8)
EMC_AB12: EMC (U1.A14), MEM (U2.H5 U3.7)
EMC_AB13: EMC (U1.A15), MEM (U2.G3 U3.6)
EMC_AB14: EMC (U1.B13), MEM (U2.G4 U3.5)
EMC_AB15: EMC (U1.B14), MEM (U2.F3 U3.4)
EMC_AB16: EMC (U1.C14), MEM (U2.F4 U3.3)
EMC_AB17: EMC (U1.C15), MEM (U2.E4 U3.54)
EMC_AB18: EMC (U1.B16), MEM (U2.D3 U3.19)
EMC_AB19: EMC (U1.B17), MEM (U2.H1 U3.18)
EMC_AB20: EMC (U1.F13), MEM (U2.G2 U3.11)
EMC_AB21: EMC (U1.F14), MEM (U2.H6 U3.12)
EMC_AB22: EMC (U1.C17), MEM (U2.E3 U3.15)
EMC_AB23: EMC (U1.C18), MEM (U2.J4)
EMC_BYTE_nEN0: EMC (U1.B9), MEM (U2.A1)
EMC_BYTE_nEN1: EMC (U1.C9), MEM (U2.B2)
EMC_DB0: EMC (U1.K2), MEM (U2.B6 U3.35)
EMC_DB1: EMC (U1.K3), MEM (U2.C5 U3.37)
EMC_DB2: EMC (U1.K5), MEM (U2.C6 U3.39)
EMC_DB3: EMC (U1.J4), MEM (U2.D5 U3.41)
EMC_DB4: EMC (U1.J3), MEM (U2.E5 U3.44)
EMC_DB5: EMC (U1.J2), MEM (U2.F5 U3.46)
EMC_DB6: EMC (U1.J1), MEM (U2.F6 U3.48)
EMC_DB7: EMC (U1.H1), MEM (U2.G6 U3.50)
EMC_DB8: EMC (U1.H3), MEM (U2.B1 U3.36)
EMC_DB9: EMC (U1.G3), MEM (U2.C1 U3.38)
EMC_DB10: EMC (U1.F4), MEM (U2.C2 U3.40)
EMC_DB11: EMC (U1.G5), MEM (U2.D2 U3.42)
EMC_DB12: EMC (U1.D2), MEM (U2.E2 U3.45)
EMC_DB13: EMC (U1.D3), MEM (U2.F2 U3.47)
EMC_DB14: EMC (U1.C1), MEM (U2.F1 U3.49)
EMC_DB15: EMC (U1.B1), MEM (U2.G1 U3.51)
EMC_nCS_FL: EMC (U1.A6), MEM (U3.32)
EMC_nCS_RAM: EMC (U1.A5), MEM (U2.B5)
EMC_nOE_FL: EMC (U1.C10), MEM (U3.34)
EMC_nOE_RAM: EMC (U1.D10), MEM (U2.A2)
EMC_nRW: EMC (U1.B6), MEM (U2.G5 U3.13)
NetQ2_1: Analog (U1.AB20), PWR_Gen (Q2.1)
nRESET: MEM (U3.14), MSS_IO (6 pins), Ethernet (U8.48), RTC (U22.16)
PU_N: Analog (U1.W17), PWR_Gen (P15.1)
RF_~{CS}: Fabric_IO (U1.H20), RF (P13.3 R82.2)
RF_DIN: Fabric_IO (U1.J22), RF (P13.1 R81.2)
RF_~{RX}/TX: Fabric_IO (U1.L18), RF (R77.1), RF_2 (R93.1)
RF_~{SHDN}: Fabric_IO (U1.M18), RF (R80.1)
RF_SCLK: Fabric_IO (U1.L22), RF (P13.2 R83.2)
RF_TX_I_N: DAC (C82.2 J7.1 R14.1), RF (U10.44)
RF_TX_I_P: DAC (C81.2 J6.1 R13.1), RF (U10.45)
RF_TX_Q_N: DAC (C84.2 J9.1 R16.1), RF (U10.42)
RF_TX_Q_P: DAC (C83.2 J8.1 R15.1), RF (U10.43)
RMII_CRSDV: MSS_IO (U1.W4), Ethernet (R30.1)
RMII_MDC: MSS_IO (U1.AA3), Ethernet (U8.2)
RMII_MDIO: MSS_IO (U1.V4), Ethernet (R26.1 U8.1)
RMII_REF_CLK: MSS_IO (U1.T6), Ethernet (R53.2)
RMII_RX_ER: MSS_IO (U1.AA4), Ethernet (U8.11)
RMII_RXD0: MSS_IO (U1.V5), Ethernet (R27.1)
RMII_RXD1: MSS_IO (U1.U5), Ethernet (R29.1)
RMII_TXD0: MSS_IO (U1.AA5), Ethernet (R19.1)
RMII_TXD1: MSS_IO (U1.W5), Ethernet (R22.1)
RMII_TXEN: MSS_IO (U1.Y4), Ethernet (U8.16)
RSSI_~{CS}: Fabric_IO (U1.H17), RF (P12.3 U11.6)
RSSI_SCLK: Fabric_IO (U1.H18), RF (P12.2 U11.4)
RSSI_SDATA: Fabric_IO (U1.H22), RF (P12.1 U11.5)
RTC_CLKOUT: Analog (U1.AA18), RTC (J34.1 U22.7)
RTC_INT: Fabric_IO (U1.B7), RTC (U22.17)
RTC_SCL: MSS_IO (U1.AA22), RTC (U22.1)
RTC_SDA: MSS_IO (U1.W21), RTC (U22.4)
RTC_SDI: MSS_IO (U1.T17), RTC (U22.2)
RTC_SDO: MSS_IO (U1.V19), RTC (U22.3)
RXRF_N: RF (U10.5), RF_2 (U20.3)
RXRF_P: RF (U10.4), RF_2 (U20.4)
TXRF_N: RF (U10.10), RF_2 (C188.1)
TXRF_P: RF (U10.9), RF_2 (C187.1)
UART_0_RXD: usb_uart (U12.1), MSS_IO (U1.U18)
UART_0_TXD: usb_uart (U12.5), MSS_IO (U1.Y22)
VCC1.5_INT: Analog (U1.Y18), PWR_Gen (5 pins)